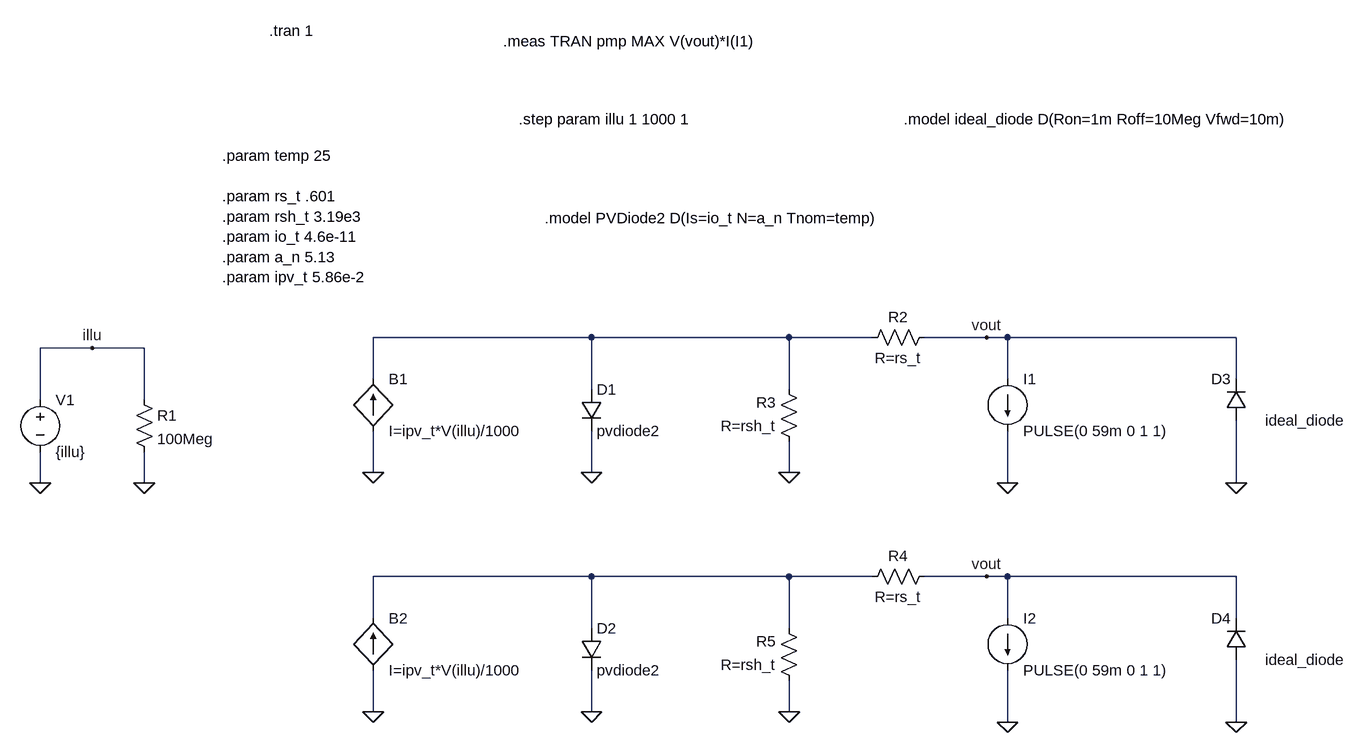
[diagram p0: schematic SM141K04TFS_Mode.asc]
SM141K04TFS_Mode.asc, the LTspice schematic file:
Version 4
SHEET 1 2140 756
WIRE 976 80 640 80
WIRE 1280 80 976 80
WIRE 1408 80 1280 80
WIRE 1584 80 1488 80
WIRE 1616 80 1584 80
WIRE 1968 80 1616 80
WIRE 208 96 128 96
WIRE 288 96 208 96
WIRE 640 144 640 80
WIRE 1616 144 1616 80
WIRE 1968 144 1968 80
WIRE 976 160 976 80
WIRE 1280 160 1280 80
WIRE 128 176 128 96
WIRE 288 176 288 96
WIRE 640 288 640 224
WIRE 976 288 976 224
WIRE 1280 288 1280 240
WIRE 128 304 128 256
WIRE 288 304 288 256
WIRE 1616 304 1616 224
WIRE 1968 304 1968 208
WIRE 976 448 640 448
WIRE 1280 448 976 448
WIRE 1408 448 1280 448
WIRE 1584 448 1488 448
WIRE 1616 448 1584 448
WIRE 1968 448 1616 448
WIRE 640 512 640 448
WIRE 1616 512 1616 448
WIRE 1968 512 1968 448
WIRE 976 528 976 448
WIRE 1280 528 1280 448
WIRE 640 656 640 592
WIRE 976 656 976 592
WIRE 1280 656 1280 608
WIRE 1616 672 1616 592
WIRE 1968 672 1968 576
FLAG 128 304 0
FLAG 288 304 0
FLAG 208 96 illu
FLAG 1616 304 0
FLAG 1280 288 0
FLAG 976 288 0
FLAG 640 288 0
FLAG 1584 80 vout
FLAG 1616 672 0
FLAG 1280 656 0
FLAG 976 656 0
FLAG 640 656 0
FLAG 1584 448 vout
FLAG 1968 304 0
FLAG 1968 672 0
SYMBOL voltage 128 160 R0
SYMATTR InstName V1
SYMATTR Value {illu}
SYMBOL res 272 160 R0
SYMATTR InstName R1
SYMATTR Value 100Meg
SYMBOL current 1616 144 R0
WINDOW 123 0 0 Left 0
WINDOW 39 0 0 Left 0
SYMATTR InstName I1
SYMATTR Value PULSE(0 59m 0 1 1)
SYMBOL res 1504 64 R90
WINDOW 0 0 56 VBottom 2
WINDOW 3 32 56 VTop 2
SYMATTR InstName R2
SYMATTR Value R=rs_t
SYMBOL res 1296 256 R180
WINDOW 0 36 76 Left 2
WINDOW 3 36 40 Left 2
SYMATTR InstName R3
SYMATTR Value R=rsh_t
SYMBOL diode 960 160 R0
SYMATTR InstName D1
SYMATTR Value pvdiode2
SYMBOL bi2 640 144 R0
SYMATTR InstName B1
SYMATTR Value I=ipv_t*V(illu)/1000
SYMBOL current 1616 512 R0
WINDOW 123 0 0 Left 0
WINDOW 39 0 0 Left 0
SYMATTR InstName I2
SYMATTR Value PULSE(0 59m 0 1 1)
SYMBOL res 1504 432 R90
WINDOW 0 0 56 VBottom 2
WINDOW 3 32 56 VTop 2
SYMATTR InstName R4
SYMATTR Value R=rs_t
SYMBOL res 1296 624 R180
WINDOW 0 36 76 Left 2
WINDOW 3 36 40 Left 2
SYMATTR InstName R5
SYMATTR Value R=rsh_t
SYMBOL diode 960 528 R0
SYMATTR InstName D2
SYMATTR Value pvdiode2
SYMBOL bi2 640 512 R0
SYMATTR InstName B2
SYMATTR Value I=ipv_t*V(illu)/1000
SYMBOL diode 1984 208 R180
WINDOW 0 24 64 Left 2
WINDOW 3 -152 0 Left 2
SYMATTR InstName D3
SYMATTR Value ideal_diode
SYMBOL diode 1984 576 R180
WINDOW 0 24 64 Left 2
WINDOW 3 -152 0 Left 2
SYMATTR InstName D4
SYMATTR Value ideal_diode
TEXT 904 -104 Left 2 !.model PVDiode2 D(Is=io_t N=a_n Tnom=temp)
TEXT 408 -200 Left 2 !.param temp 25\n \n.param rs_t .601\n.param rsh_t 3.19e3\n.param io_t 4.6e-11\n.param a_n 5.13\n.param ipv_t 5.86e-2
TEXT 864 -256 Left 2 !.step param illu 1 1000 1
TEXT 480 -392 Left 2 !.tran 1
TEXT 840 -376 Left 2 !.meas TRAN pmp MAX V(vout)*I(I1)
TEXT 1456 -256 Left 2 !.model ideal_diode D(Ron=1m Roff=10Meg Vfwd=10m)

The netlist it stands for:
* SM141K04TFS_Mode.asc
V1 illu 0 {illu}
R1 illu 0 100Meg
I1 vout 0 PULSE(0 59m 0 1 1)
R2 vout N001 R=rs_t
R3 0 N001 R=rsh_t
D1 N001 0 pvdiode2
B1 0 N001 I=ipv_t*V(illu)/1000
I2 vout 0 PULSE(0 59m 0 1 1)
R4 vout N002 R=rs_t
R5 0 N002 R=rsh_t
D2 N002 0 pvdiode2
B2 0 N002 I=ipv_t*V(illu)/1000
D3 0 vout ideal_diode
D4 0 vout ideal_diode
.model D D
.lib standard.dio
.model PVDiode2 D(Is=io_t N=a_n Tnom=temp)
.param temp 25
.param rs_t .601
.param rsh_t 3.19e3
.param io_t 4.6e-11
.param a_n 5.13
.param ipv_t 5.86e-2
.step param illu 1 1000 1
.tran 1
.meas TRAN pmp MAX V(vout)*I(I1)
.model ideal_diode D(Ron=1m Roff=10Meg Vfwd=10m)
.backanno
.end